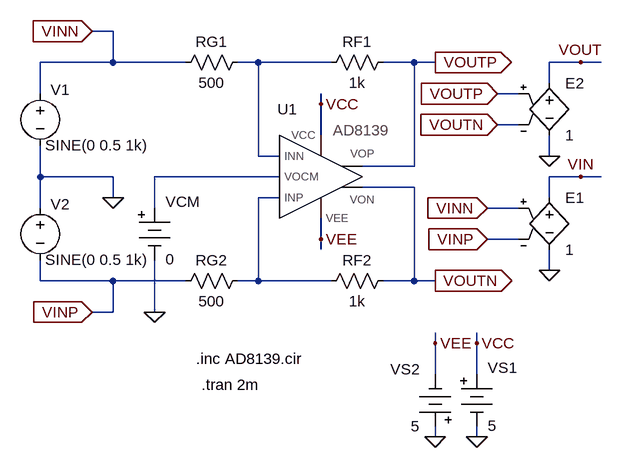
[diagram p0: schematic fig-02-05-18(a).asc]
fig-02-05-18(a).asc, the LTspice schematic file:
Version 4
SHEET 1 1332 680
WIRE -64 -176 -96 -176
WIRE -64 -128 -64 -176
WIRE -64 -128 -176 -128
WIRE 48 -128 -64 -128
WIRE 160 -128 128 -128
WIRE 272 -128 160 -128
WIRE 400 -128 352 -128
WIRE 432 -128 400 -128
WIRE 656 -128 608 -128
WIRE 688 -128 656 -128
WIRE 608 -96 608 -128
WIRE -176 -80 -176 -128
WIRE 560 -80 528 -80
WIRE 256 -64 256 -80
WIRE 560 -32 528 -32
WIRE 256 -16 256 -64
WIRE 160 16 160 -128
WIRE 192 16 160 16
WIRE 608 16 608 -16
WIRE 400 32 400 -128
WIRE 400 32 320 32
WIRE -176 48 -176 0
WIRE -64 48 -176 48
WIRE 192 48 0 48
WIRE 656 48 608 48
WIRE 688 48 656 48
WIRE 400 64 320 64
WIRE -64 80 -64 48
WIRE 192 80 160 80
WIRE 608 80 608 48
WIRE -176 96 -176 48
WIRE 0 96 0 48
WIRE 560 96 512 96
WIRE 256 144 256 112
WIRE 560 144 512 144
WIRE 256 160 256 144
WIRE 608 192 608 160
WIRE -176 208 -176 176
WIRE -64 208 -176 208
WIRE 48 208 -64 208
WIRE 160 208 160 80
WIRE 160 208 128 208
WIRE 272 208 160 208
WIRE 400 208 400 64
WIRE 400 208 352 208
WIRE 432 208 400 208
WIRE -64 256 -64 208
WIRE -64 256 -96 256
WIRE 0 256 0 176
WIRE 432 304 432 288
WIRE 496 304 496 288
WIRE 432 352 432 304
WIRE 496 352 496 304
WIRE 432 448 432 432
WIRE 496 448 496 432
FLAG -64 80 0
FLAG 432 -128 VOUTP
IOPIN 432 -128 Out
FLAG 0 256 0
FLAG 432 448 0
FLAG 496 448 0
FLAG 432 304 VEE
FLAG 496 304 VCC
FLAG 256 -64 VCC
FLAG 256 144 VEE
FLAG 432 208 VOUTN
IOPIN 432 208 Out
FLAG 608 16 0
FLAG 528 -32 VOUTN
IOPIN 528 -32 In
FLAG 528 -80 VOUTP
IOPIN 528 -80 In
FLAG 656 -128 VOUT
FLAG -96 -176 VINN
IOPIN -96 -176 In
FLAG -96 256 VINP
IOPIN -96 256 In
FLAG 608 192 0
FLAG 512 144 VINP
IOPIN 512 144 In
FLAG 512 96 VINN
IOPIN 512 96 In
FLAG 656 48 VIN
SYMBOL res 368 -144 R90
WINDOW 0 0 56 VBottom 2
WINDOW 3 32 56 VTop 2
SYMATTR InstName RF1
SYMATTR Value 1k
SYMBOL res 144 -144 R90
WINDOW 0 0 56 VBottom 2
WINDOW 3 32 56 VTop 2
SYMATTR InstName RG1
SYMATTR Value 500
SYMBOL voltage -176 -96 R0
WINDOW 0 31 26 Bottom 2
WINDOW 3 87 111 Bottom 2
WINDOW 123 35 89 Top 2
WINDOW 39 0 0 Left 0
SYMATTR InstName V1
SYMATTR Value SINE(0 0.5 1k)
SYMBOL Misc\\battery 496 336 R0
WINDOW 0 17 6 Left 2
WINDOW 3 17 95 Left 2
WINDOW 123 0 0 Left 0
WINDOW 39 0 0 Left 0
SYMATTR InstName VS1
SYMATTR Value 5
SYMBOL Misc\\battery 432 448 R180
WINDOW 0 24 104 Left 2
WINDOW 3 24 16 Left 2
WINDOW 123 0 0 Left 0
WINDOW 39 0 0 Left 0
SYMATTR InstName VS2
SYMATTR Value 5
SYMBOL AD8139-sub 256 48 R0
WINDOW 0 -51 -88 Bottom 2
SYMATTR InstName U1
SYMATTR Value AD8139
SYMATTR Prefix X
SYMBOL res 368 192 R90
WINDOW 0 0 56 VBottom 2
WINDOW 3 32 56 VTop 2
SYMATTR InstName RF2
SYMATTR Value 1k
SYMBOL res 144 192 R90
WINDOW 0 0 56 VBottom 2
WINDOW 3 32 56 VTop 2
SYMATTR InstName RG2
SYMATTR Value 500
SYMBOL Misc\\battery 0 80 R0
WINDOW 0 17 6 Left 2
WINDOW 3 17 95 Left 2
WINDOW 123 0 0 Left 0
WINDOW 39 0 0 Left 0
SYMATTR InstName VCM
SYMATTR Value 0
SYMBOL voltage -176 80 R0
WINDOW 0 31 26 Bottom 2
WINDOW 3 87 111 Bottom 2
WINDOW 123 35 89 Top 2
WINDOW 39 0 0 Left 0
SYMATTR InstName V2
SYMATTR Value SINE(0 0.5 1k)
SYMBOL e 608 -112 R0
SYMATTR InstName E2
SYMATTR Value 1
SYMBOL e 608 64 R0
SYMATTR InstName E1
SYMATTR Value 1
TEXT 64 328 Left 2 !.inc AD8139.cir
TEXT 72 368 Left 2 !.tran 2m

The netlist it stands for:
* fig-02-05-18(a).asc
RF1 VOUTP N001 1k
RG1 N001 VINN 500
V1 VINN 0 SINE(0 0.5 1k)
VS1 VCC 0 5
VS2 0 VEE 5
XU1 N001 N002 VCC VOUTP VOUTN VEE N003 AD8139-sub params: AD8139  ; pins INN VOCM VCC VOP VON VEE INP
RF2 VOUTN N003 1k
RG2 N003 VINP 500
VCM N002 0 0
V2 0 VINP SINE(0 0.5 1k)
E2 VOUT 0 VOUTP VOUTN 1
E1 VIN 0 VINN VINP 1
.inc AD8139.cir
.tran 2m
.backanno
.end